# Altium schematic sheet SLT3-PAY-1Q2T_P6.SchDoc
size A4
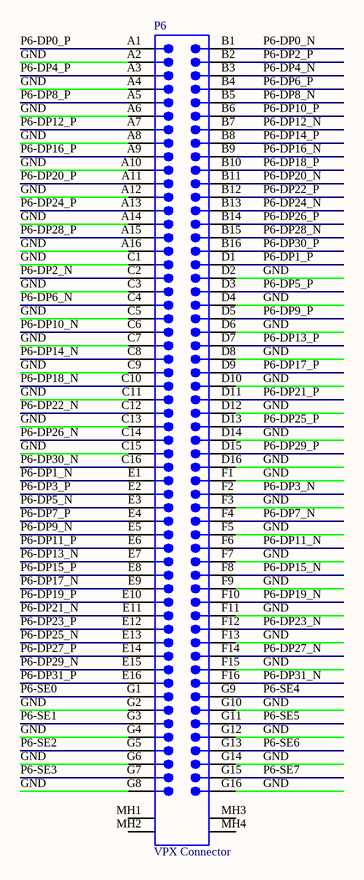
[diagram p0: SLT3-PAY-1Q2T_P6.SchDoc]

## Parts
P6  VPX Connector  [BTB1-8-4H112M]

## Nets
GND: P6.A2 P6.A4 P6.A6 P6.A8 P6.A10 P6.A12 P6.A14 P6.A16 P6.C1 P6.C3 P6.C5 P6.C7 P6.C9 P6.C11 P6.C13 P6.C15 P6.D2 P6.D4 P6.D6 P6.D8 P6.D10 P6.D12 P6.D14 P6.D16 P6.F1 P6.F3 P6.F5 P6.F7 P6.F9 P6.F11 P6.F13 P6.F15 P6.G2 P6.G4 P6.G6 P6.G8 P6.G10 P6.G12 P6.G14 P6.G16
P6-DP0_N: P6.B1
P6-DP0_P: P6.A1
P6-DP1_N: P6.E1
P6-DP1_P: P6.D1
P6-DP2_N: P6.C2
P6-DP2_P: P6.B2
P6-DP3_N: P6.F2
P6-DP3_P: P6.E2
P6-DP4_N: P6.B3
P6-DP4_P: P6.A3
P6-DP5_N: P6.E3
P6-DP5_P: P6.D3
P6-DP6_N: P6.C4
P6-DP6_P: P6.B4
P6-DP7_N: P6.F4
P6-DP7_P: P6.E4
P6-DP8_N: P6.B5
P6-DP8_P: P6.A5
P6-DP9_N: P6.E5
P6-DP9_P: P6.D5
P6-DP10_N: P6.C6
P6-DP10_P: P6.B6
P6-DP11_N: P6.F6
P6-DP11_P: P6.E6
P6-DP12_N: P6.B7
P6-DP12_P: P6.A7
P6-DP13_N: P6.E7
P6-DP13_P: P6.D7
P6-DP14_N: P6.C8
P6-DP14_P: P6.B8
P6-DP15_N: P6.F8
P6-DP15_P: P6.E8
P6-DP16_N: P6.B9
P6-DP16_P: P6.A9
P6-DP17_N: P6.E9
P6-DP17_P: P6.D9
P6-DP18_N: P6.C10
P6-DP18_P: P6.B10
P6-DP19_N: P6.F10
P6-DP19_P: P6.E10
P6-DP20_N: P6.B11
P6-DP20_P: P6.A11
P6-DP21_N: P6.E11
P6-DP21_P: P6.D11
P6-DP22_N: P6.C12
P6-DP22_P: P6.B12
P6-DP23_N: P6.F12
P6-DP23_P: P6.E12
P6-DP24_N: P6.B13
P6-DP24_P: P6.A13
P6-DP25_N: P6.E13
P6-DP25_P: P6.D13
P6-DP26_N: P6.C14
P6-DP26_P: P6.B14
P6-DP27_N: P6.F14
P6-DP27_P: P6.E14
P6-DP28_N: P6.B15
P6-DP28_P: P6.A15
P6-DP29_N: P6.E15
P6-DP29_P: P6.D15
P6-DP30_N: P6.C16
P6-DP30_P: P6.B16
P6-DP31_N: P6.F16
P6-DP31_P: P6.E16
P6-SE0: P6.G1
P6-SE1: P6.G3
P6-SE2: P6.G5
P6-SE3: P6.G7
P6-SE4: P6.G9
P6-SE5: P6.G11
P6-SE6: P6.G13
P6-SE7: P6.G15

Not connected (* = marked no-connect by the designer): P6 MH1 MH2 MH3 MH4

## Library data of the parts
P6 = 2102771-1: Ruggedized Board-to-Board Connector, Right Angle, 7-Row, Pitch 1.8mm, 112-Position; Manufacturer: TE; Bonding: No; ComponentHeigth: 14.7mm; PressFit: No; Case: *; Component Kind: Standard; Component Type: Standard; CreateDate: 2018-01-01; Device: *; Footprint: *; HelpURL: *; LatestRevisionDate: 2018-01-01; Manufacturer Part Number: 2102771-1; Mounted: Yes; PackageDescription: 2102771-1; Part Description: Ruggedized Board-to-Board Connector, Right Angle, 7-Row, Pitch 1.8mm, 112-Position; Part Number: 2102771-1; Pin Count: *; Sense: No; SMD: Yes; Socket: No; Family: VPX Connector